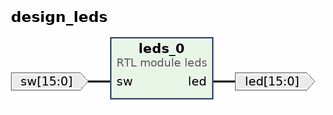
[diagram p0: block diagram of the top level]
# Vivado block design design_leds, xc7a35tcpg236-1, Vivado 2026.1
create_bd_design design_leds

create_bd_port -dir I -from 15 -to 0 sw
create_bd_port -dir O -from 15 -to 0 led

create_bd_cell -type module -reference leds leds_0

# ---- connections ----

connect_bd_net [get_bd_pins leds_0/led] [get_bd_ports led]
connect_bd_net -net sw_0_1 [get_bd_ports sw] [get_bd_pins leds_0/sw]

validate_bd_design
save_bd_design
